# Altium project YingHuoDisplay.PrjPCB
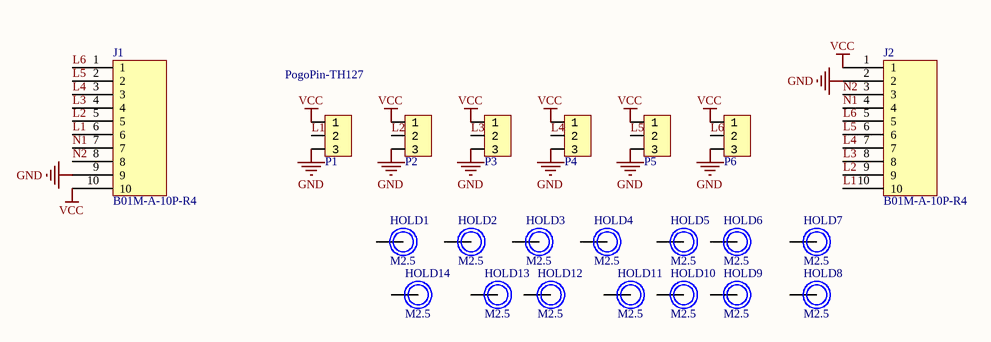
[diagram p0: YingHuoDispaly.SchDoc]
1 sheet, 22 parts. Net scope: global (net labels, ports and power ports of the same name join across sheets).
Board file: YingHuoDispaly.PcbDoc

## Sheet YingHuoDispaly.SchDoc
size A3

### Parts
HOLD1  M2.5  [Hold_M2.5S]
HOLD2  M2.5  [Hold_M2.5S]
HOLD3  M2.5  [Hold_M2.5S]
HOLD4  M2.5  [Hold_M2.5S]
HOLD5  M2.5  [Hold_M2.5S]
HOLD6  M2.5  [Hold_M2.5S]
HOLD7  M2.5  [Hold_M2.5S]
HOLD8  M2.5  [Hold_M2.5S]
HOLD9  M2.5  [Hold_M2.5S]
HOLD10  M2.5  [Hold_M2.5S]
HOLD11  M2.5  [Hold_M2.5S]
HOLD12  M2.5  [Hold_M2.5S]
HOLD13  M2.5  [Hold_M2.5S]
HOLD14  M2.5  [Hold_M2.5S]
J1  B01M-A-10P-R4  [JL-B01M-10]
J2  B01M-A-10P-R4  [JL-B01M-10]
P1  PogoPin-TH127  [YingHuoPin_3]
P2  PogoPin-TH127  [YingHuoPin_3]  (value not drawn)
P3  PogoPin-TH127  [YingHuoPin_3]  (value not drawn)
P4  PogoPin-TH127  [YingHuoPin_3]  (value not drawn)
P5  PogoPin-TH127  [YingHuoPin_3]  (value not drawn)
P6  PogoPin-TH127  [YingHuoPin_3]  (value not drawn)

### Nets
GND: J1.9 J2.2 P1.3 P2.3 P3.3 P4.3 P5.3 P6.3
VCC: J1.10 J2.1 P1.1 P2.1 P3.1 P4.1 P5.1 P6.1
L1: J1.6 J2.10 P1.2
L2: J1.5 J2.9 P2.2
L3: J1.4 J2.8 P3.2
L4: J1.3 J2.7 P4.2
L5: J1.2 J2.6 P5.2
L6: J1.1 J2.5 P6.2
N1: J1.7 J2.4
N2: J1.8 J2.3

Not connected (* = marked no-connect by the designer): HOLD1 1; HOLD2 1; HOLD3 1; HOLD4 1; HOLD5 1; HOLD6 1; HOLD7 1; HOLD8 1; HOLD9 1; HOLD10 1; HOLD11 1; HOLD12 1; HOLD13 1; HOLD14 1

### Library data of the parts
HOLD1-HOLD14 = Hold_M3
J1 J2 = HDR1x10
P1-P6 = HDR1x3_1.27: Header